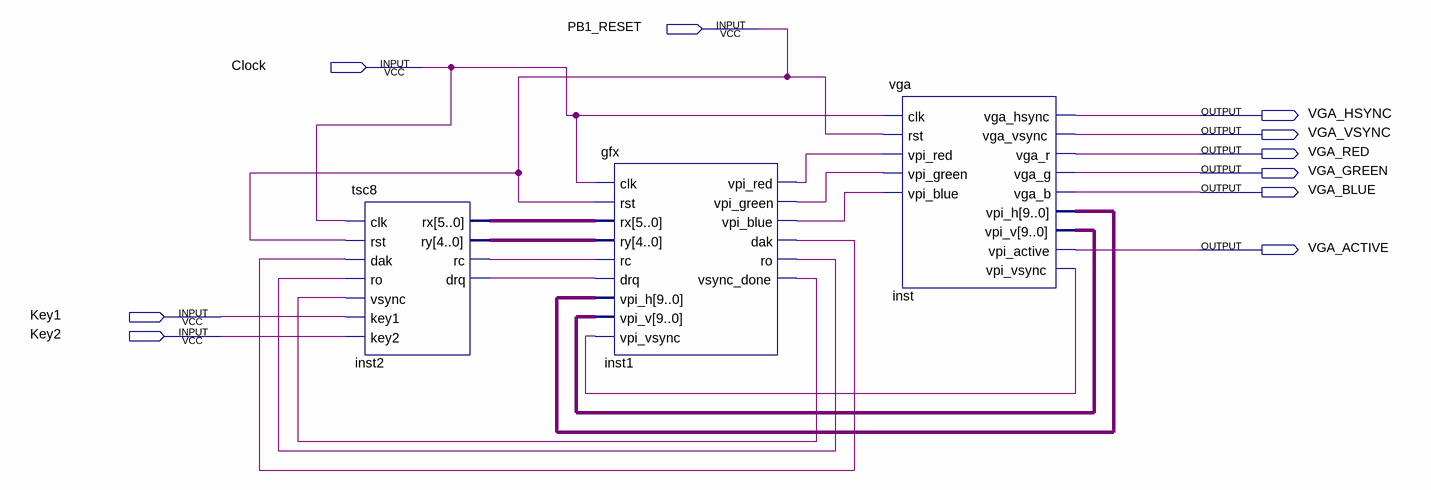
[diagram p0: schematic sheet]
// Quartus schematic Chip8.bdf as structural Verilog: 3 symbols, 10 pins
module Chip8 (
  input  PB1_RESET,
  input  Clock,
  input  Key1,
  input  Key2,
  output VGA_HSYNC,
  output VGA_VSYNC,
  output VGA_RED,
  output VGA_GREEN,
  output VGA_BLUE,
  output VGA_ACTIVE
);

  wire inst1_dak, inst1_ro, inst1_vpi_blue, inst1_vpi_green, inst1_vpi_red, inst1_vsync_done, inst2_drq,
       inst2_rc, inst_vpi_vsync;
  wire [4:0] inst2_ry;
  wire [5:0] inst2_rx;
  wire [9:0] inst_vpi_h, inst_vpi_v;

  tsc8 inst2 (
    .clk(Clock), .rst(PB1_RESET), .dak(inst1_dak), .ro(inst1_ro), .vsync(inst1_vsync_done), .key1(Key1),
    .key2(Key2), .rx(inst2_rx), .ry(inst2_ry), .rc(inst2_rc), .drq(inst2_drq));
  gfx inst1 (
    .clk(Clock), .rst(PB1_RESET), .rx(inst2_rx), .ry(inst2_ry), .rc(inst2_rc), .drq(inst2_drq),
    .vpi_h(inst_vpi_h), .vpi_v(inst_vpi_v), .vpi_vsync(inst_vpi_vsync), .vpi_red(inst1_vpi_red),
    .vpi_green(inst1_vpi_green), .vpi_blue(inst1_vpi_blue), .dak(inst1_dak), .ro(inst1_ro),
    .vsync_done(inst1_vsync_done));
  vga inst (
    .clk(Clock), .rst(PB1_RESET), .vpi_red(inst1_vpi_red), .vpi_green(inst1_vpi_green),
    .vpi_blue(inst1_vpi_blue), .vga_hsync(VGA_HSYNC), .vga_vsync(VGA_VSYNC), .vga_r(VGA_RED),
    .vga_g(VGA_GREEN), .vga_b(VGA_BLUE), .vpi_h(inst_vpi_h), .vpi_v(inst_vpi_v), .vpi_active(VGA_ACTIVE),
    .vpi_vsync(inst_vpi_vsync));
endmodule
